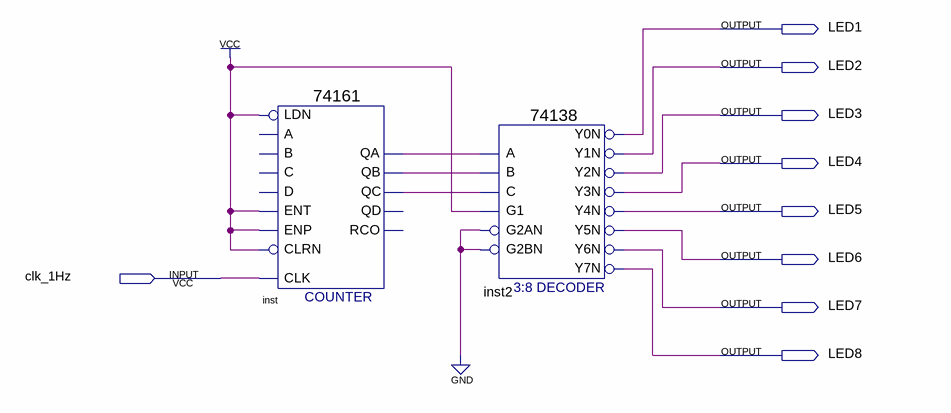
[diagram p0: schematic sheet]
// Quartus schematic kzdl.bdf as structural Verilog: 2 symbols, 9 pins
module kzdl (
  input  clk_1Hz,
  output LED1,
  output LED2,
  output LED3,
  output LED4,
  output LED5,
  output LED6,
  output LED7,
  output LED8
);

  wire inst_qa, inst_qb, inst_qc;

  \74161  inst (
    .CLRN(1'b1), .CLK(clk_1Hz), .ENP(1'b1), .LDN(1'b1), .ENT(1'b1), .QC(inst_qc), .QB(inst_qb), .QA(inst_qa));  // open: A, D, B, C, QD, RCO
  \74138  inst2 (
    .A(inst_qa), .B(inst_qb), .G1(1'b1), .C(inst_qc), .G2AN(1'b0), .G2BN(1'b0), .Y0N(LED1), .Y1N(LED2),
    .Y2N(LED3), .Y3N(LED4), .Y4N(LED5), .Y5N(LED6), .Y6N(LED7), .Y7N(LED8));
endmodule
